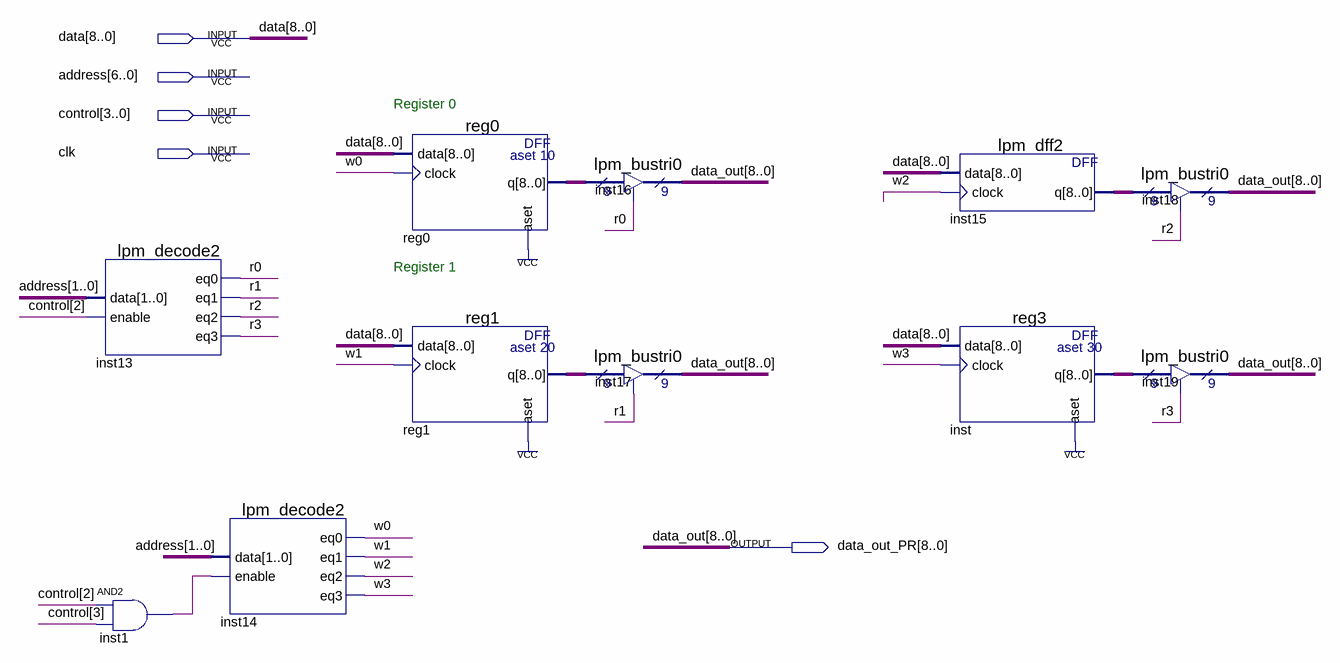
[diagram p0: schematic sheet]
// Quartus schematic processor_registers.bdf as structural Verilog: 11 symbols, 5 pins
module processor_registers (
  input  [8:0] data,
  input  [6:0] address,
  input  [3:0] control,
  input  clk,
  output [8:0] data_out_PR
);

  wire inst1_out, r0, r1, r2, r3, w0, w1, w2, w3;
  wire [8:0] inst15_q, inst_q, reg0_q, reg1_q;

  lpm_decode2 inst13 (.data(address[1:0]), .enable(control[2]), .eq0(r0), .eq1(r1), .eq2(r2), .eq3(r3));
  and inst1 (inst1_out, control[2], control[3]);
  lpm_decode2 inst14 (.data(address[1:0]), .enable(inst1_out), .eq0(w0), .eq1(w1), .eq2(w2), .eq3(w3));
  reg0 reg0 (.data(data), .clock(w0), .aset(1'b1), .q(reg0_q));
  reg1 reg1 (.data(data), .clock(w1), .aset(1'b1), .q(reg1_q));
  lpm_bustri0 inst16 (.enabledt(r0), .data(reg0_q), .tridata(data_out_PR));
  lpm_bustri0 inst17 (.enabledt(r1), .data(reg1_q), .tridata(data_out_PR));
  lpm_dff2 inst15 (.data(data), .clock(w2), .q(inst15_q));
  reg3 inst (.data(data), .clock(w3), .aset(1'b1), .q(inst_q));
  lpm_bustri0 inst18 (.enabledt(r2), .data(inst15_q), .tridata(data_out_PR));
  lpm_bustri0 inst19 (.enabledt(r3), .data(inst_q), .tridata(data_out_PR));

  // Other names for the same wires on the sheet: data_out[8:0] = data_out_PR

  // Notes on the sheet:
  //   Register 0
  //   Register 1
endmodule
